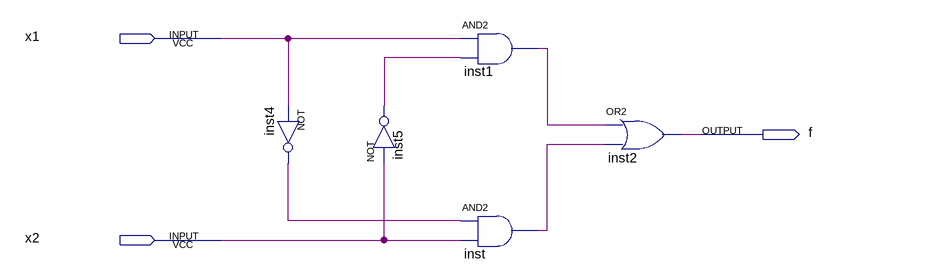
[diagram p0: schematic sheet]
// Quartus schematic lab1.bdf as structural Verilog: 5 symbols, 3 pins
module lab1 (
  input  x1,
  input  x2,
  output f
);

  wire inst1_out, inst4_out, inst5_out, inst_out;

  not inst4 (inst4_out, x1);
  not inst5 (inst5_out, x2);
  and inst1 (inst1_out, x1, inst5_out);
  and inst (inst_out, inst4_out, x2);
  or inst2 (f, inst1_out, inst_out);
endmodule
